# EAGLE design monjolo_a (EAGLE 5.10)
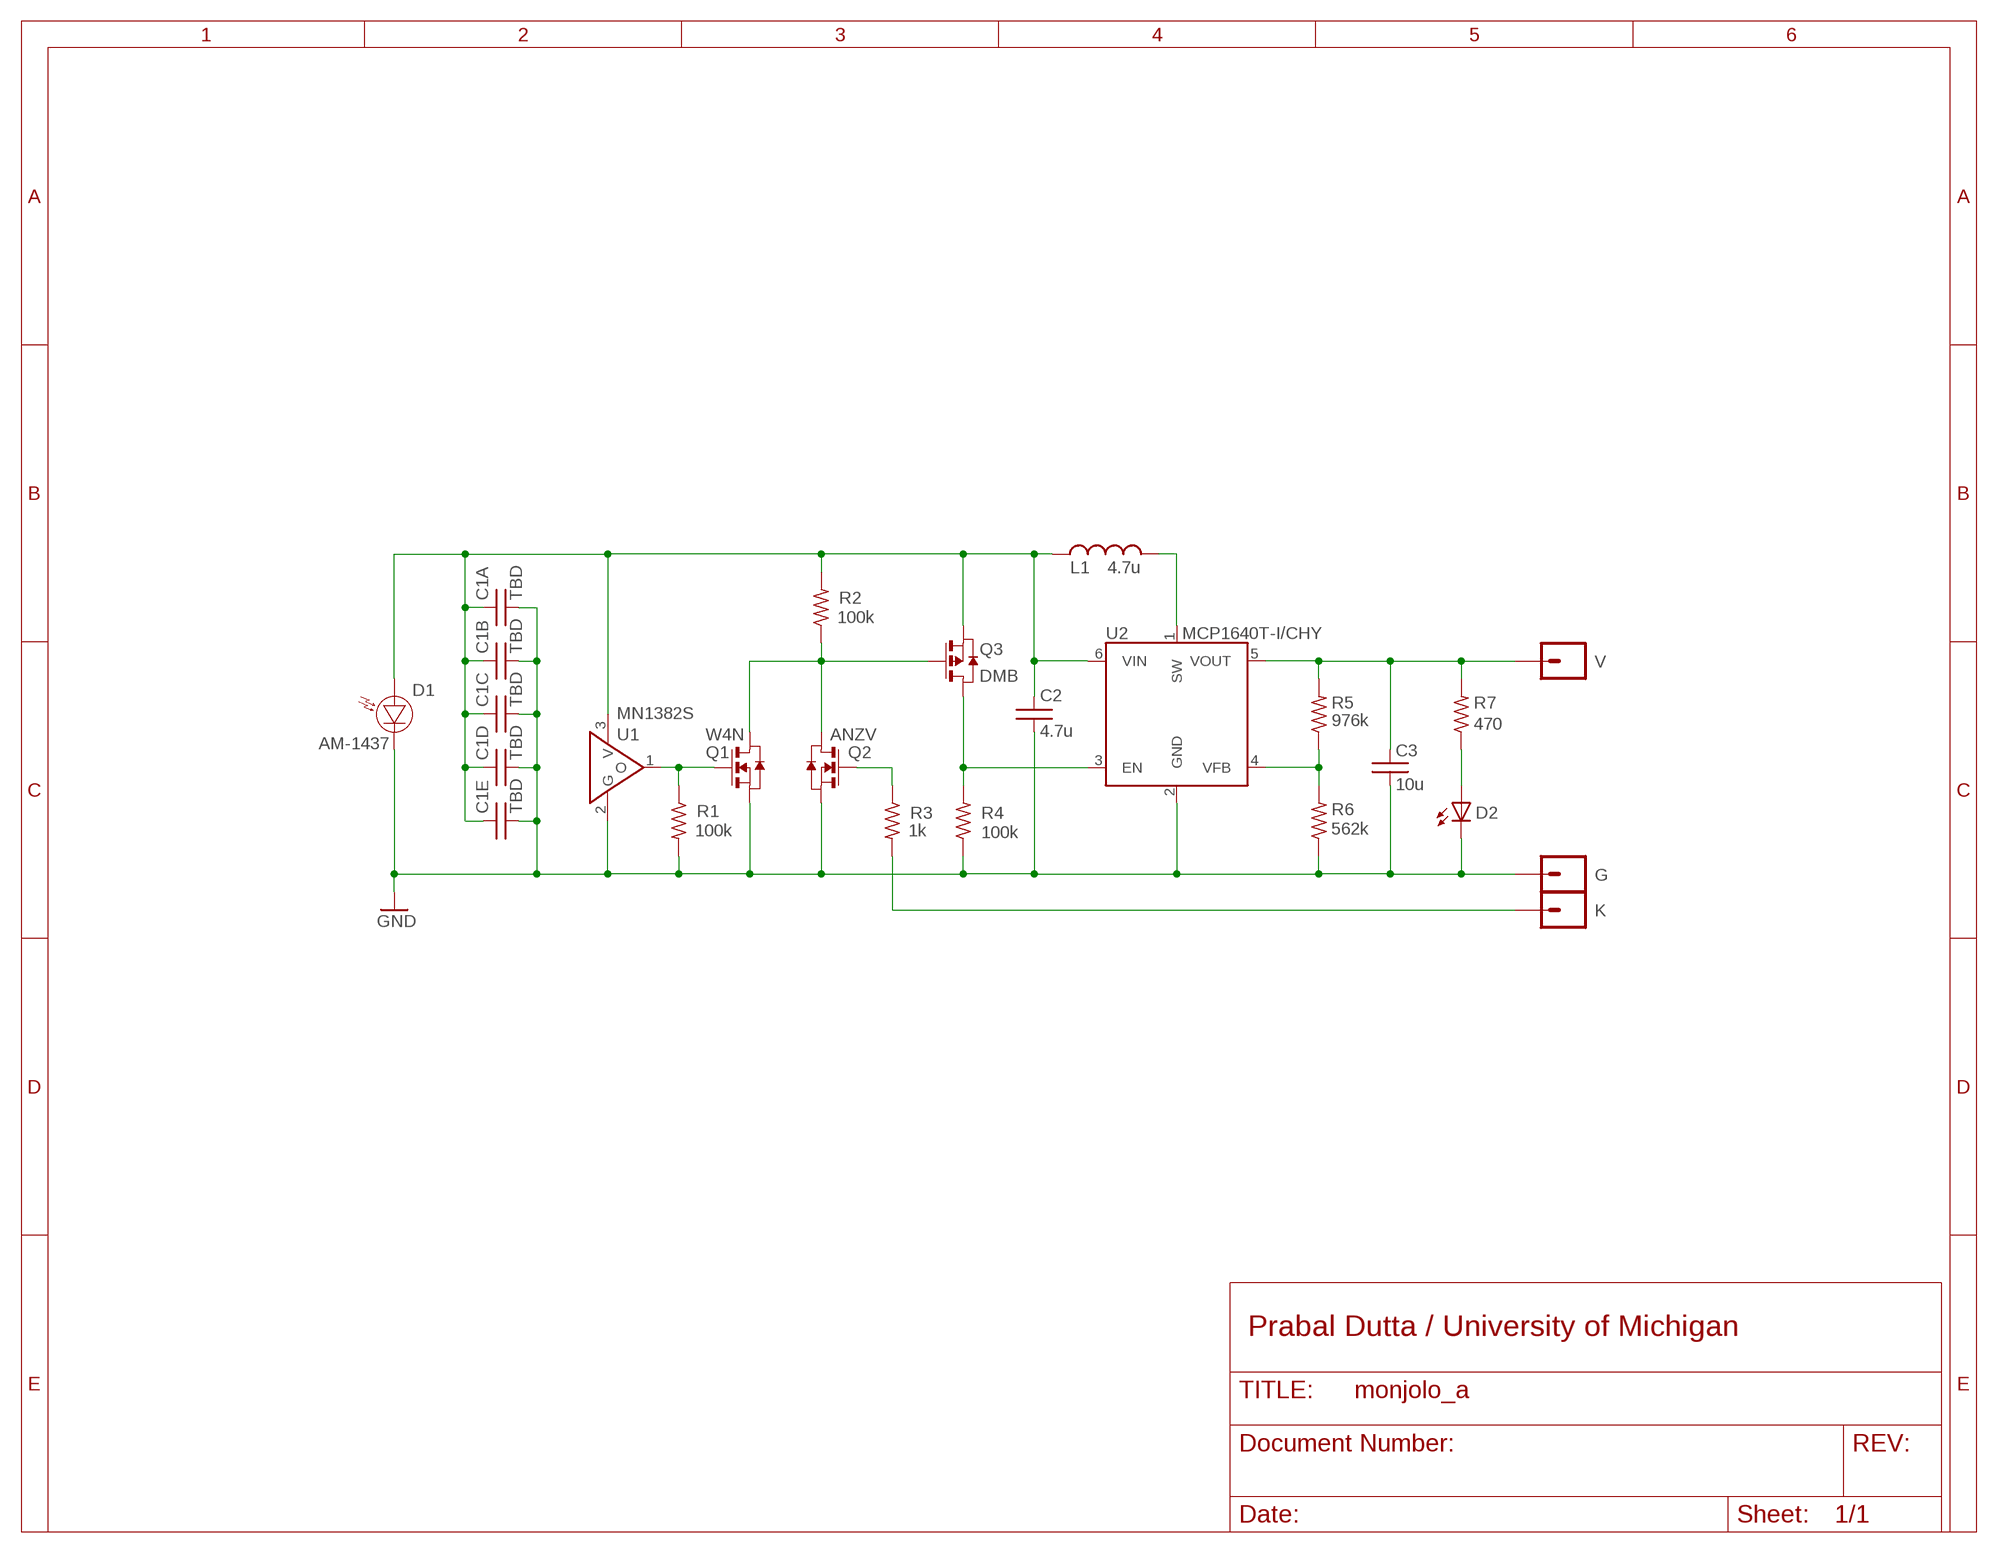
[diagram p0: schematic, sheet 1]

## Parts
C1A  TBD  C1210  [C1210]
C1B  TBD  C1210  [C1210]
C1C  TBD  C1210  [C1210]
C1D  TBD  C1210  [C1210]
C1E  TBD  C1210  [C1210]
C2  4.7u  C0603  [C0603]
C3  10u  C0805  [C0805]
D1  AM-1437  [AM-1437]
D2  LED0603  [LED-0603]
G  M01PTH  [1X01]
K  M01PTH  [1X01]
L1  4.7u  L-USL2828  [L2828]
Q1  W4N  NMOSSOT23  [SOT-23]
Q2  ANZV  NMOSSOT23  [SOT-23]
Q3  DMB  PMOSSOT23  [SOT-23]
R1  100k  R-US_R0603  [R0603]
R2  100k  R-US_R0603  [R0603]
R3  1k  R-US_R0603  [R0603]
R4  100k  R-US_R0603  [R0603]
R5  976k  R-US_R0603  [R0603]
R6  562k  R-US_R0603  [R0603]
R7  470  R-US_R0603  [R0603]
U1  MN1382S  [MINI-3DC]
U2  MCP1640T-I/CHY  MCP1640  [SOT23-6]
V  M01PTH  [1X01]

## Nets
GND: C1A.2 C1B.2 C1C.2 C1D.2 C1E.2 C2.2 C3.2 D1.-(C) D2.C G.1 Q1.2(S) Q2.2(S) R1.2 R4.1 R6.1 U1.2(G) U2.2(GND)
N$1: R5.1 R6.2 U2.4(VFB)
N$2: C1A.1 C1B.1 C1C.1 C1D.1 C1E.1 C2.1 D1.+(A) L1.1 Q3.2(S) R2.2 U1.3(V) U2.6(VIN)
N$3: C3.1 R5.2 R7.2 U2.5(VOUT) V.1
N$4: L1.2 U2.1(SW)
N$5: D2.A R7.1
N$8: K.1 R3.2
N$9: Q1.1(D) Q2.1(D) Q3.3(G) R2.1
N$18: Q3.1(D) R4.2 U2.3(EN)
N$20: Q2.3(G) R3.1
N$23: Q1.3(G) R1.1 U1.1(O)

## Notes on the sheet
- Prabal Dutta / University of Michigan

## Library data of the parts
C1A C1B C1C C1D C1E C2 C3 = umich:C
D1 = umich:AM-1437
D2 = umich:LED: LEDs Standard schematic elements and footprints for 5mm, 3mm, 1206, and 0603 sized LEDs. 5mm - Spark Fun Electronics SKU : COM-00529 (and others)
G K V = SparkFun:M01: Header 1 Standard 1-pin 0.1" header. Use with straight break away headers (SKU : PRT-00116), right angle break away headers (PRT-00553), swiss pins (PRT-00743), machine pins (PRT-00117), and female headers (PRT-00115).
L1 = umich:L-US: INDUCTOR, American symbol
Q1 Q2 = berkeley-epic:NMOSSOT23: MOS FET
Q3 = berkeley-epic:PMOSSOT23: MOS FET
R1-R4 = rcl:R-US_: RESISTOR, American symbol
R5-R7 = resistor:R-US_: RESISTOR, American symbol
U1 = umich:MN1382S
U2 = umich:MCP1640

## Board
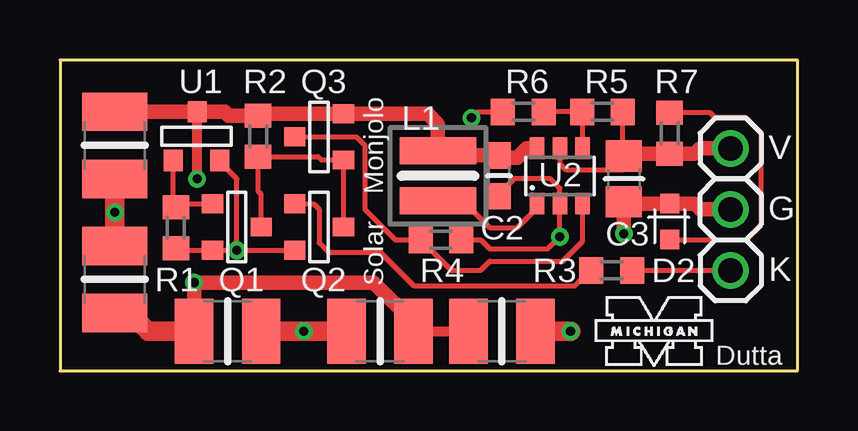
[diagram p1: board, top side]
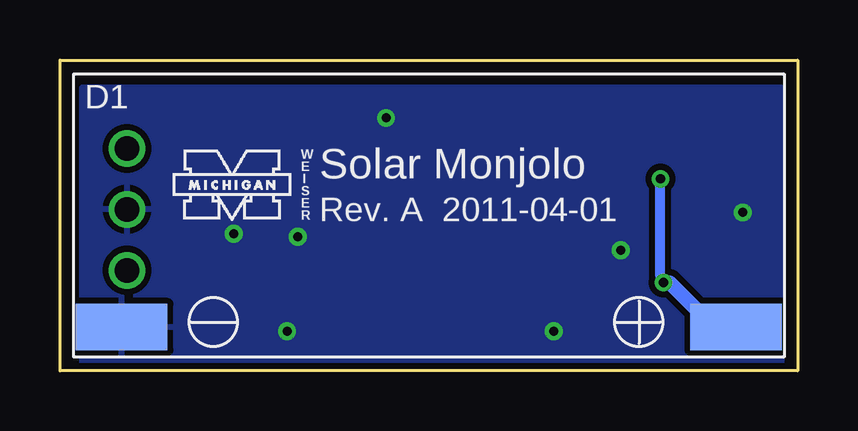
[diagram p2: board, bottom side, seen from below]

Size 30.73 x 12.95 mm. Coordinates in mm from the lower left corner, seen from the top.
Outline: 30.73,0 30.73,12.95 0,12.95 0,0 30.73,0
Copper layers (1*16): Top 0.035mm / dielectric 1.5mm / Bottom 0.035mm
Design rules "default *": minimum track width 8mil, minimum drill 12mil, track to track 8mil, track to pad 8mil, pad to pad 8mil, via to via 8mil, smd to smd 6mil, copper to edge 8mil, drill to drill 8mil, minimum pad ring 5mil, minimum via ring 7mil, stop-mask expansion 4mil, vias tented up to drill 20mil, thermal gap 10mil

### Footprints (pad centres in the part's own frame; a part is rotated, then mirrored left to right if it is on the bottom)
C1210 = smd 1.6 x 2.7: 1 -1.4,0; 2 1.4,0
C0603 = smd 1.1 x 1: 1 -0.85,0; 2 0.85,0
C0805 = smd 1.3 x 1.5: 1 -0.95,0; 2 0.95,0
AM-1437 = smd 3.81 x 1.93: + 12.8,-4.65; - -12.8,-4.65
LED-0603 = smd 0.8 x 0.8: A 0,-0.75; C 0,0.75
1X01 = drill 1.016 round: 1 0,0
L2828 = smd 1.118 x 3.2: 1 -1.041,0; 2 1.041,0
SOT-23 = smd 0.787 x 0.889: 1 0.025,-1.016; 2 -0.94,1.016; 3 0.991,1.016
R0603 = smd 1 x 1.1: 1 -0.85,0; 2 0.85,0
MINI-3DC = smd 0.787 x 0.889: 1 -0.991,-1.016; 2 0.94,-1.016; 3 0,1.016
SOT23-6 = smd 0.6 x 0.9: 1 -0.95,-1.15; 2 0,-1.15; 3 0.95,-1.15; 4 0.95,1.15; 5 0,1.15; 6 -0.95,1.15

### Placement (x,y rotation side)
C1A  2.29,9.4 270 top
C1B  2.29,3.81 90 top
C1C  6.99,1.65 0 top
C1D  13.34,1.65 180 top
C1E  18.41,1.65 0 top
C2  18.29,8.13 270 top
C3  23.5,8 270 top
D1  15.37,6.48 0 bottom
D2  25.4,6.22 0 top
G  27.94,6.73 90 top
K  27.94,4.19 0 top
L1  15.75,8.13 270 top
Q1  7.37,5.97 90 top
Q2  10.79,5.97 90 top
Q3  10.79,9.78 270 top
R1  4.83,5.97 270 top
R2  8.26,9.78 90 top
R3  22.99,4.19 0 top
R4  15.88,5.46 180 top
R5  22.61,10.79 0 top
R6  19.3,10.79 0 top
R7  25.4,9.91 270 top
U1  5.71,9.78 0 top
U2  20.83,8.13 0 top
U$1  [UMICH]  26.1,6.1 0 bottom
U$2  [UMICH]  22.23,0 0 top
V  27.94,9.27 0 top

### Tracks (layer width: path | path; a pad name or v marks a point on that pad's centre or on a via)
GND  (via drill 0.38)
  Top 0.203: C2.2 18.29,7.37 18.92,8 20.45,8 20.83,7.62 U2.2 v20.83,5.59 20.32,5.08 17.91,5.08 17.53,5.46 R4.1 | v7.37,5.03 Q1.2 4.92,5.03 R1.2 | v7.37,5.03 Q2.2 | U1.2 6.66,8.71 7.37,8 v7.37,5.03 | C3.2 23.57,6.97 | R6.1 17.4,10.79 v17.14,10.54
  Top 0.406: C1D.2 10.79,1.78
  Top 0.61: C3.2 v23.5,5.71 | 23.57,6.97 D2.C 26.43,6.97 26.67,6.73 G.1
  Top 0.813: C1A.2 v2.29,6.6 C1B.2 2.38,5.12 | C1C.2 v10.16,1.65 C1D.2 | C1E.2 v21.27,1.65
  pour Bottom (isolate 0.254): 0.64,0.38 0.64,11.81 29.84,11.81 29.84,0.38
N$1
  Top 0.203: 20.25,10.7 R6.2 R5.1 21.78,10.77 U2.4
N$2  (via drill 0.38)
  Top 0.203: L1.1 15.94,8.98 | C2.1 18.38,8.89
  Top 0.406: C1E.1 C1D.1 14.73,1.78 14.73,2.03 | C1A.1 | v5.71,8 U1.3
  Top 0.61: 15.94,8.98 C2.1 | U2.6 19.44,9.28 19.05,8.89 18.38,8.89 | L1.1 15.75,10.29 15.32,10.72 Q3.2 8.31,10.72 8.22,10.63 | C1C.1 5.58,3.3 v5.59,3.68 13.08,3.68 14.73,2.03 | C1A.1 U1.3 6.86,10.79 7.02,10.63 8.22,10.63 | 8.22,10.63 R2.2
  Top 0.813: C1B.1 2.92,2.41 3.68,1.65 C1C.1
  Bottom 0.406: v5.71,8 5.71,3.94 v5.59,3.68
  Bottom 0.61: D1.+ 3.48,1.83 5.33,3.68 v5.59,3.68
N$3
  Top 0.203: U2.5 20.83,8.64 21.08,8.38 23.5,8.38 C3.1 | R5.2 23.46,8.99 C3.1 | C3.1 23.6,9.06
  Top 0.61: 23.6,9.06 R7.2 26.45,9.06 26.67,9.27 V.1
N$4
  Top 0.203: L1.2 16.79,7.09 17.91,5.97 19.05,5.97 19.88,6.8 U2.1
N$5
  Top 0.203: D2.A 28.59,5.47 29.21,6.1 29.21,9.91 28.57,10.54 27.3,10.54 27.09,10.76 R7.1
N$8
  Top 0.203: R3.2 K.1
N$9
  Top 0.203: Q1.1 8.38,7.37 8.26,7.49 R2.1 10.76,8.93 10.9,8.79 Q3.3 Q2.1
N$18
  Top 0.203: Q3.1 12.34,9.75 12.7,9.4 12.7,6.73 13.97,5.46 R4.2 16.3,4.19 17.53,4.19 17.91,4.57 20.95,4.57 21.78,5.39 U2.3
N$20
  Top 0.203: Q2.3 10.57,6.96 10.79,6.73 10.79,5.33 11.18,4.95 13.34,4.95 14.73,3.56 21.46,3.56 21.72,3.81 R3.1
N$23
  Top 0.203: U1.1 4.72,6.92 R1.1 4.97,6.96 Q1.3

### Text on the board
tPlace: Monjolo | Solar | Dutta
bPlace: W | Solar Monjolo | I | E | E | S | Rev. A 2011-04-01 | R